# Altium schematic sheet Sheet1.SchDoc
size A4; SheetNumber: 1; SheetTotal: 1
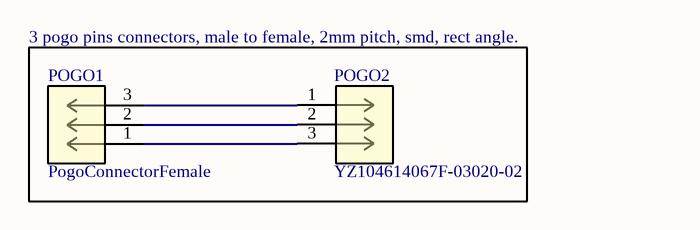
[diagram p0: Sheet1.SchDoc]

## Parts
POGO1  PogoConnectorFemale  [PogoConnectorFemale]
POGO2  YZ104614067F-03020-02  [YZ104614067F-03020-02]

## Nets
NetPOGO1_1: POGO1.1 POGO2.3
NetPOGO1_2: POGO1.2 POGO2.2
NetPOGO1_3: POGO1.3 POGO2.1

## Notes on the sheet
- 3 pogo pins connectors, male to female, 2mm pitch, smd, rect angle.

## Library data of the parts
POGO2 = YZ104614067F-03020-02: Pogo pin connector, Pitch 2mm, SMD, Rectangular Angle, 3 Pins, Male; Manufacturer Part Number: YZ104614067F-03020-02